# EasyEDA Pro project ProPrj_ESP32-CNC_2025-08-15.epro, board PCB1
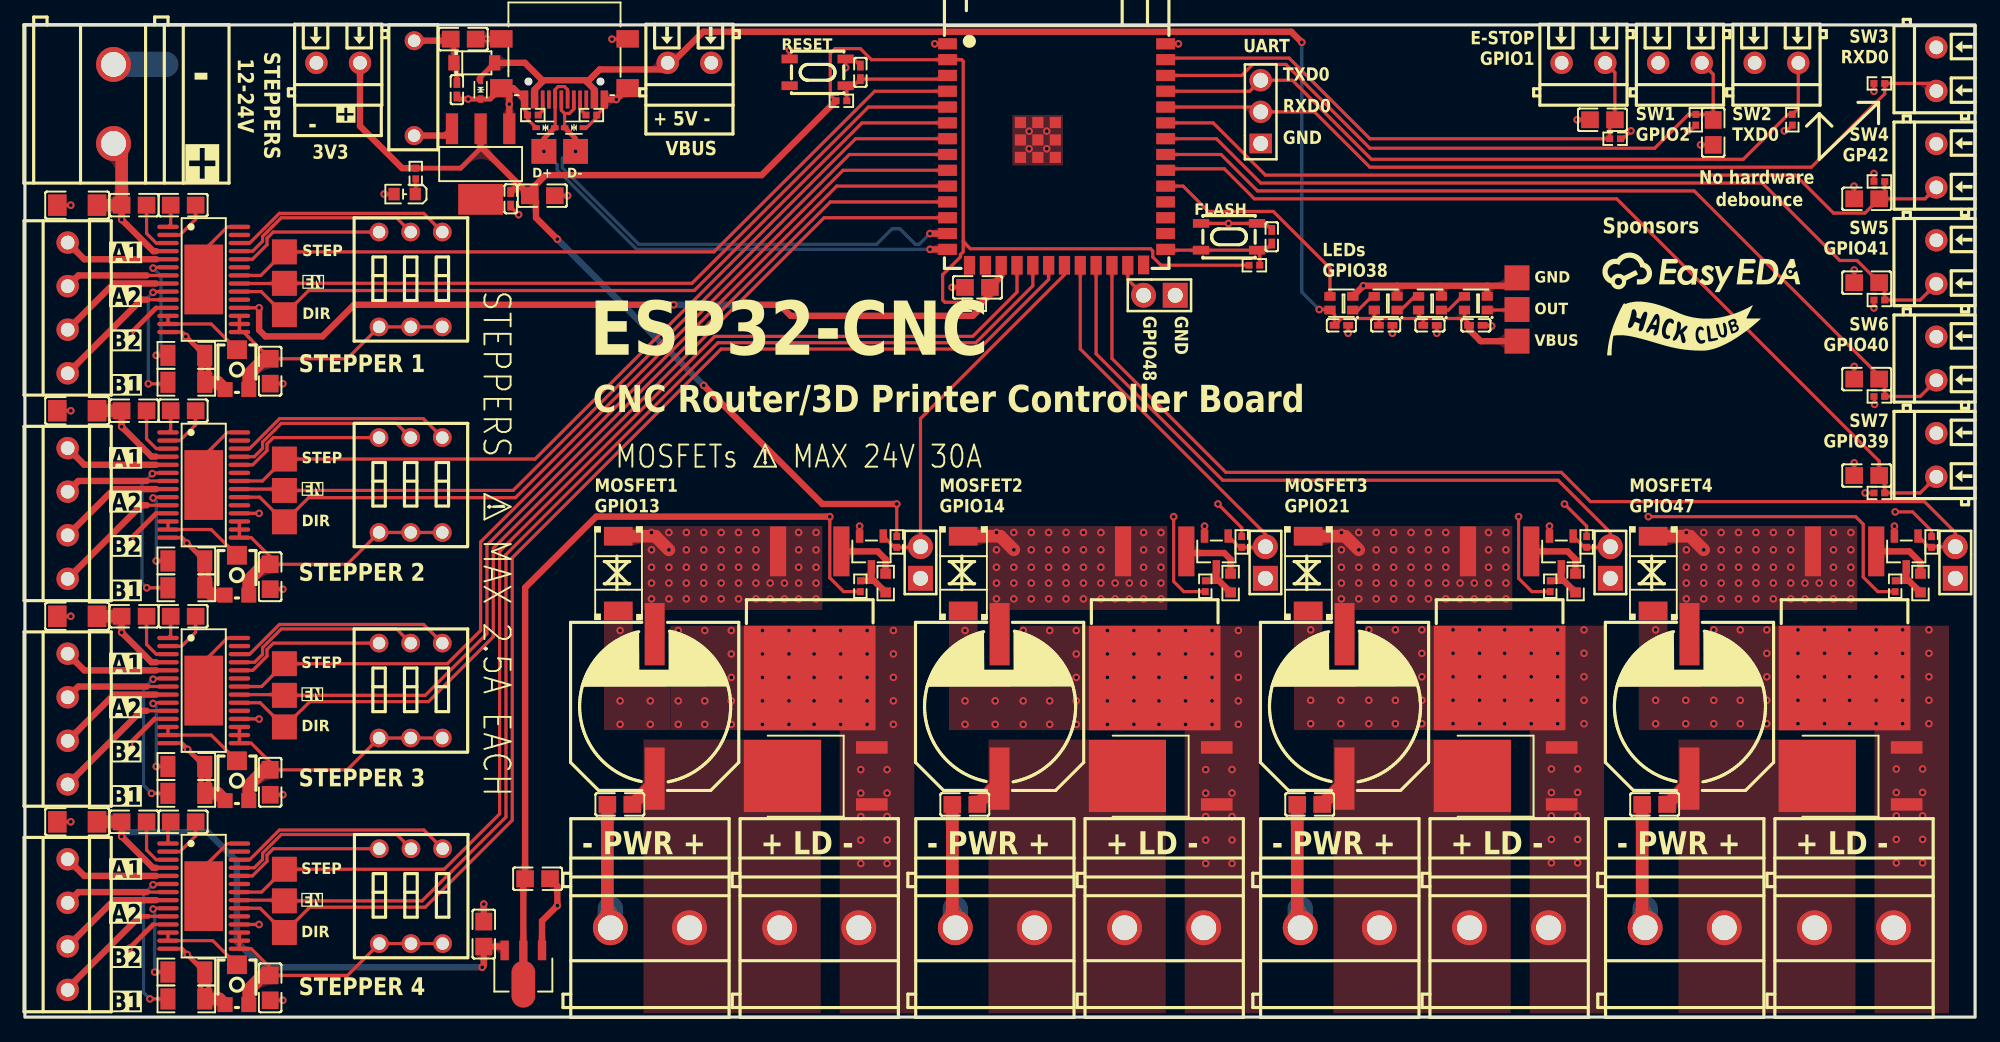
[diagram p1: board, top side]
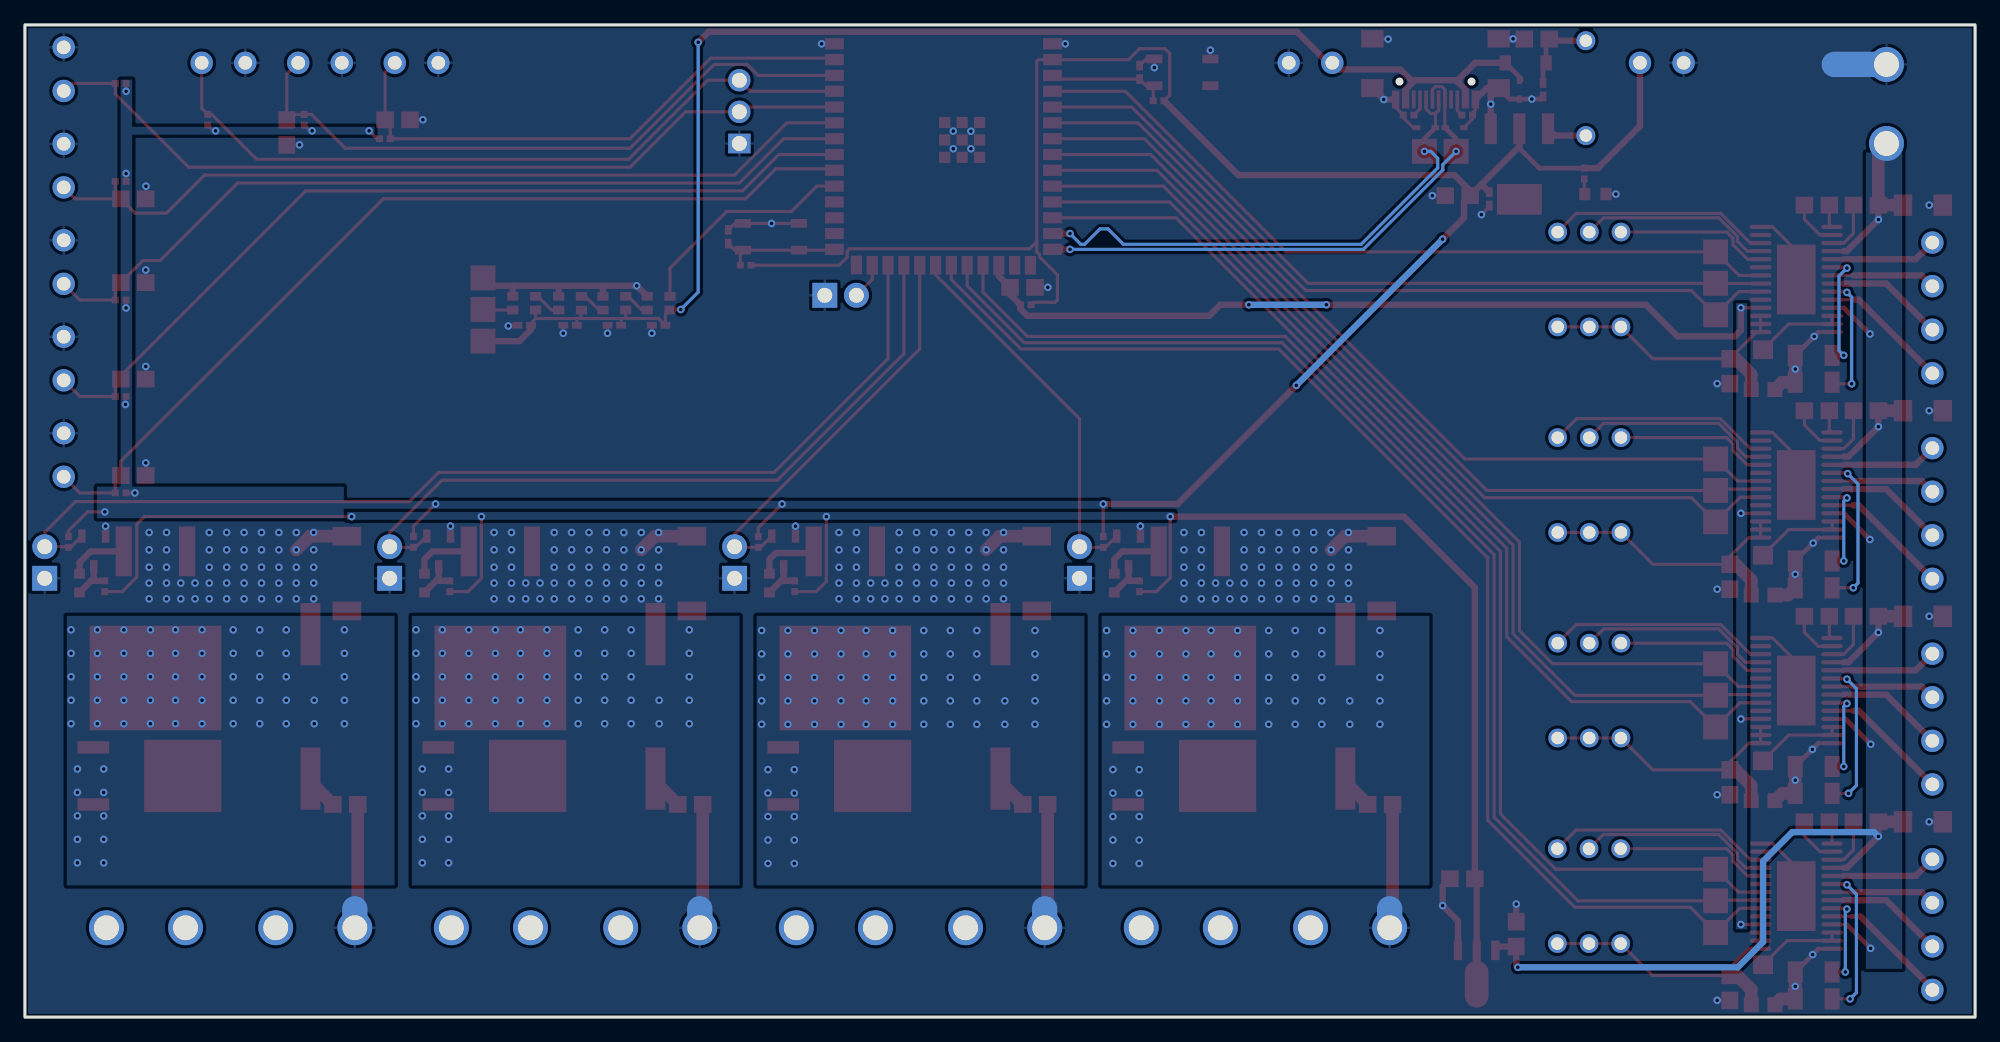
[diagram p2: board, bottom side, seen from below]

Outline 156.53 x 79.69 mm; copper layers: Top Layer, Bottom Layer. Coordinates in mm from the lower left corner of the outline.
Outline path: rectangle 0,79.69 156.53,0
Stack: Top Layer 0.035mm / Dielectric1 1.51mm FR4 er 4.5 / Bottom Layer 0.035mm

## Design rules (mm)
net D+: DP1
net D-: DP1
template: JLCPCB Capability(Two Layers Board)
spacing copperThickness1oz (default): track to track 0.102, other pairs 0.152 to 0.3
spacing copperThickness2oz: track to track 0.203, other pairs 0.152 to 0.3
track width copperThickness1oz (default): min 0.127, default 0.254, max 2.54
track width copperThickness2oz: min 0.203, default 0.254, max 2.54
differential pair differentialPair (default): width min 0.127, default 0.254, max 2.54; gap min 0.152, default 0.152
via viaSize (default): diameter min 0.5, default 0.61, max 10; hole min 0.3, default 0.305, max 6.3

## Placement (name value [footprint] x y rotation side)
C1  100nF  [C0805]  41.53 65.98 180 top
C2  100nF  [C0805]  35.18 78.55 0 top
C3  10uF  [C0402]  34.67 74.49 90 top
C4  10uF  [C0402]  38.99 65.72 90 top
C5  1uF  [C0402]  67.06 75.88 270 top
C8  100nF  [C0805]  8.76 32.2 0 top
C9  10nF  [C0805]  12.7 32.2 180 top
C10  470uF  [CAP-SMD_BD12.5-L13.0-W13.0-RD]  105.92 24.96 270 top
C11  100nF  [C0805]  103.12 17.08 0 top
C12  2.2uF  [C0805]  36.83 6.67 270 top
C14  2.2uF  [C0805]  41.15 11.11 180 top
C15  470nF  [C0805]  19.69 18.86 90 top
C18  4.7uF  [C1206]  4.19 65.22 0 top
C19  2.2uF  [C0805]  76.45 58.61 0 top
C21  10nF  [C0805]  12.7 15.69 180 top
C22  470nF  [C0805]  19.69 2.35 90 top
C23  100nF  [C0805]  8.76 15.69 0 top
C24  100nF  [C0805]  126.62 72.07 180 top
C25  100nF  [C0805]  135.51 71.06 270 top
C31  4.7uF  [C1206]  4.19 32.2 0 top
C34  4.7uF  [C1206]  4.19 48.71 0 top
C37  4.7uF  [C1206]  4.19 15.69 0 top
C40  10nF  [C0805]  12.7 65.22 180 top
C41  470nF  [C0805]  19.69 51.88 90 top
C42  100nF  [C0805]  8.76 65.22 0 top
C43  10nF  [C0805]  12.7 48.71 180 top
C44  470nF  [C0805]  19.69 35.37 90 top
C45  100nF  [C0805]  8.76 48.71 0 top
C46  100nF  [C0805]  147.83 65.72 180 top
C47  100nF  [C0805]  147.83 58.99 180 top
C48  100nF  [C0805]  147.83 51.25 180 top
C49  100nF  [C0805]  147.83 43.5 180 top
C50  470uF  [CAP-SMD_BD12.5-L13.0-W13.0-RD]  133.6 24.96 270 top
C51  100nF  [C0805]  130.81 17.08 0 top
C52  470uF  [CAP-SMD_BD12.5-L13.0-W13.0-RD]  50.55 24.96 270 top
C53  100nF  [C0805]  47.75 17.08 0 top
C54  470uF  [CAP-SMD_BD12.5-L13.0-W13.0-RD]  78.23 24.96 270 top
C55  100nF  [C0805]  75.44 17.08 0 top
C60  1uF  [C0402]  100.08 62.68 270 top
C61  10uF  [C0402]  105.66 55.56 0 top
C62  10uF  [C0402]  109.22 55.56 0 top
C63  10uF  [C0402]  112.78 55.56 0 top
C64  10uF  [C0402]  116.46 55.56 0 top
D1  LESD5D5.0CT1G  [SOD-523_L1.2-W0.8-LS1.6-BI]  41.78 71.44 0 top
D2  LESD5D5.0CT1G  [SOD-523_L1.2-W0.8-LS1.6-BI]  44.07 71.44 180 top
D3  LESD5D5.0CT1G  [SOD-523_L1.2-W0.8-LS1.6-BI]  36.58 74.49 90 top
D4  1N5819HW-7-F  [SOD-123_L2.7-W1.6-LS3.7-RD]  36.07 76.65 0 top
D6  SMBJ24CA  [SMBG_L4.3-W3.6-LS6.2-BI]  103 35.62 270 top
D7  SMBJ24CA  [SMBG_L4.3-W3.6-LS6.2-BI]  130.68 35.62 270 top
D8  SMBJ24CA  [SMBG_L4.3-W3.6-LS6.2-BI]  47.62 35.62 270 top
D9  SMBJ24CA  [SMBG_L4.3-W3.6-LS6.2-BI]  75.31 35.62 270 top
D+  -  [Test-Point-0.5mm]  41.66 69.53 0 top
D-  -  [Test-Point-0.5mm]  44.2 69.53 0 top
DIR  -  [Test-Point-0.5mm]  20.83 56.41 0 top
DIR#2  -  [Test-Point-0.5mm]  20.83 23.31 0 top
DIR#3  -  [Test-Point-0.5mm]  20.83 39.78 0 top
DIR#4  -  [Test-Point-0.5mm]  20.83 6.8 0 top
EN  -  [Test-Point-0.5mm]  20.83 9.34 0 top
EN#2  -  [Test-Point-0.5mm]  20.83 42.3 0 top
EN#3  -  [Test-Point-0.5mm]  20.83 58.94 0 top
EN#4  -  [Test-Point-0.5mm]  20.83 25.85 0 top
FLASH  TS-1089S-02526  [SW-SMD_4P-L4.2-W3.3-P2.15-LS5.1]  96.65 62.68 0 top
GND  -  [Test-Point-0.5mm]  119.76 59.37 0 top
H1  PZ254V-11-02P  [HDR-TH_2P-P2.54-V-M]  127.25 36.51 270 top
H2  PZ254V-11-02P  [HDR-TH_2P-P2.54-V-M]  154.94 36.51 270 top
H3  PZ254V-11-02P  [HDR-TH_2P-P2.54-V-M]  71.88 36.51 270 top
H4  PZ254V-11-02P  [HDR-TH_2P-P2.54-V-M]  99.57 36.51 270 top
H5  PZ254V-11-02P  [HDR-TH_2P-P2.54-V-M]  91.06 57.98 0 top
H6  2.54-1*3P针  [HDR-TH_3P-P2.54-V-M-1]  99.19 72.71 90 top
LED1  WS2812B-2020  [LED-SMD_4P-L2.0-W2.0-TL_WS2812B-2020]  105.66 57.34 180 top
LED2  A-SP192DGHC-C01-4T  [LED0603-FD]  30.48 66.1 0 top
LED3  WS2812B-2020  [LED-SMD_4P-L2.0-W2.0-TL_WS2812B-2020]  109.22 57.34 180 top
LED4  WS2812B-2020  [LED-SMD_4P-L2.0-W2.0-TL_WS2812B-2020]  112.78 57.34 180 top
LED5  WS2812B-2020  [LED-SMD_4P-L2.0-W2.0-TL_WS2812B-2020]  116.46 57.34 180 top
OUT  -  [Test-Point-0.5mm]  119.76 56.83 0 top
P1  XY350V-3.5-4P  [CONN-TH_XY350V-3.5-4P]  3.43 23.94 90 top
P2  XY350V-3.5-4P  [CONN-TH_XY350V-3.5-4P]  3.43 7.43 90 top
P3  XY350V-3.5-4P  [CONN-TH_XY350V-3.5-4P]  3.43 56.96 90 top
P4  XY350V-3.5-4P  [CONN-TH_XY350V-3.5-4P]  3.43 40.45 90 top
Q3  IRF3205STRLPBF  [TO-263-2_L10.0-W9.1-P5.08-LS15.2-TL]  118.36 32.32 270 top
Q4  BSS138LT1G  [SOT-23-3_L2.9-W1.6-P1.90-LS2.8-BR]  123.32 37.4 90 top
Q5  IRF3205STRLPBF  [TO-263-2_L10.0-W9.1-P5.08-LS15.2-TL]  146.05 32.32 270 top
Q6  BSS138LT1G  [SOT-23-3_L2.9-W1.6-P1.90-LS2.8-BR]  151 37.4 90 top
Q7  IRF3205STRLPBF  [TO-263-2_L10.0-W9.1-P5.08-LS15.2-TL]  62.99 32.32 270 top
Q8  BSS138LT1G  [SOT-23-3_L2.9-W1.6-P1.90-LS2.8-BR]  67.94 37.4 90 top
Q9  IRF3205STRLPBF  [TO-263-2_L10.0-W9.1-P5.08-LS15.2-TL]  90.68 32.32 270 top
Q10  BSS138LT1G  [SOT-23-3_L2.9-W1.6-P1.90-LS2.8-BR]  95.63 37.4 90 top
R1  5.1kΩ  [R0402]  45.47 72.45 0 top
R2  5.1kΩ  [R0402]  40.77 72.45 180 top
R3  10kΩ  [R0402]  98.68 60.39 180 top
R4  10kΩ  [R0402]  65.53 73.6 180 top
R10  200Ω  [R0402]  31.37 67.76 90 top
R11  100mΩ  [R1206]  12.95 17.97 0 top
R12  100mΩ  [R1206]  12.95 20.13 0 top
R13  22Ω  [R0603]  124.46 34.86 90 top
R14  10kΩ  [R0402]  122.43 34.61 270 top
R15  10kΩ  [R0402]  125.35 38.16 90 top
R16  10kΩ  [R0402]  76.2 57.21 180 top
R17  10kΩ  [R0402]  127.63 70.55 0 top
R18  100mΩ  [R1206]  12.95 1.46 0 top
R19  100mΩ  [R1206]  12.95 3.62 0 top
R20  10kΩ  [R0402]  134.11 72.07 270 top
R21  10kΩ  [R0402]  141.86 72.07 270 top
R22  10kΩ  [R0402]  148.84 74.99 180 top
R23  100mΩ  [R1206]  12.95 53.15 0 top
R24  100mΩ  [R1206]  12.95 50.99 0 top
R25  100mΩ  [R1206]  12.95 34.48 0 top
R26  100mΩ  [R1206]  12.95 36.64 0 top
R27  10kΩ  [R0402]  148.84 67.12 180 top
R28  10kΩ  [R0402]  148.84 57.6 180 top
R29  10kΩ  [R0402]  148.84 49.85 180 top
R30  10kΩ  [R0402]  148.84 42.1 180 top
R31  22Ω  [R0603]  152.15 34.86 90 top
R32  10kΩ  [R0402]  150.11 34.61 270 top
R33  10kΩ  [R0402]  153.03 38.16 90 top
R34  22Ω  [R0603]  69.09 34.86 90 top
R35  10kΩ  [R0402]  67.06 34.61 270 top
R36  10kΩ  [R0402]  69.98 38.16 90 top
R37  22Ω  [R0603]  96.77 34.86 90 top
R38  10kΩ  [R0402]  94.74 34.61 270 top
R39  10kΩ  [R0402]  97.66 38.16 90 top
RESET  TS-1089S-02526  [SW-SMD_4P-L4.2-W3.3-P2.15-LS5.1]  63.63 75.88 0 top
RJ1  20kΩ  [RES-ADJ-SMD_TC33X-2-104E]  17.02 18.99 0 top
RJ2  20kΩ  [RES-ADJ-SMD_TC33X-2-104E]  17.02 2.6 0 top
RJ3  20kΩ  [RES-ADJ-SMD_TC33X-2-104E]  17.02 52.01 0 top
RJ4  20kΩ  [RES-ADJ-SMD_TC33X-2-104E]  17.02 35.5 0 top
STEP  -  [Test-Point-0.5mm]  20.83 61.46 0 top
STEP#2  -  [Test-Point-0.5mm]  20.83 44.83 0 top
STEP#3  -  [Test-Point-0.5mm]  20.83 28.39 0 top
STEP#4  -  [Test-Point-0.5mm]  20.83 11.88 0 top
SW3  SMQS-03R-TP  [SW-TH_SMQS-03B-TP]  30.96 26.23 0 top
SW4  SMQS-03R-TP  [SW-TH_SMQS-03B-TP]  30.99 9.72 0 top
SW5  SMQS-03R-TP  [SW-TH_SMQS-03B-TP]  30.96 59.25 0 top
SW6  SMQS-03R-TP  [SW-TH_SMQS-03B-TP]  30.96 42.74 0 top
U1  DRV8825PWPR  [HTSSOP-28_L9.7-W4.4-P0.65-LS6.4-BL-EP]  14.35 26.23 270 top
U2  ESP32-S3-WROOM-1-N16R8  [WIRELM-SMD_ESP32-S3-WROOM-1]  82.8 69.28 0 top
U3  GT-USB-9047A  [USB-C-SMD_GT-USB-9047A]  43.31 76.14 180 top
U4  AMS1117-3.3  [SOT-223-4_L6.5-W3.5-P2.30-LS7.0-BR]  36.58 68.52 90 top
U5  DB301V-3.5-2P-GN-S  [CONN-TH_DB301V-3.5-2P-GN]  25.15 76.65 180 top
U6  SMQS-01R-TP  [SW-TH_KF1001-01P-B0-FL-ON-01B]  31.24 74.61 0 top
U7  MBR20100DT  [TO-252-2_L6.5-W6.1-P4.58-LS10.0-BL]  119.76 19.37 90 top
U9  KF635-6.35-2P  [CONN-TH_P6.35_KF635-6.35-2P]  105.54 7.18 0 top
U10  KF635-6.35-2P  [CONN-TH_P6.35_KF635-6.35-2P]  119.13 7.18 0 top
U11  CJ78L12  [SOT-89-3_L4.5-W2.5-P1.50-LS4.2-BR]  40 4 90 top
U13  KF635-6.35-2P  [CONN-TH_P6.35_KF635-6.35-2P]  7.11 73.34 270 top
U14  DB301V-3.5-2P-GN-S  [CONN-TH_DB301V-3.5-2P-GN]  125.09 76.65 180 top
U15  DRV8825PWPR  [HTSSOP-28_L9.7-W4.4-P0.65-LS6.4-BL-EP]  14.35 9.72 270 top
U16  DB301V-3.5-2P-GN-S  [CONN-TH_DB301V-3.5-2P-GN]  132.84 76.65 180 top
U17  DB301V-3.5-2P-GN-S  [CONN-TH_DB301V-3.5-2P-GN]  140.59 76.65 180 top
U18  DB301V-3.5-2P-GN-S  [CONN-TH_DB301V-3.5-2P-GN]  153.42 76.14 90 top
U19  DRV8825PWPR  [HTSSOP-28_L9.7-W4.4-P0.65-LS6.4-BL-EP]  14.35 59.25 270 top
U20  DRV8825PWPR  [HTSSOP-28_L9.7-W4.4-P0.65-LS6.4-BL-EP]  14.35 42.74 270 top
U21  DB301V-3.5-2P-GN-S  [CONN-TH_DB301V-3.5-2P-GN]  153.42 68.39 90 top
U22  DB301V-3.5-2P-GN-S  [CONN-TH_DB301V-3.5-2P-GN]  153.42 60.64 90 top
U23  DB301V-3.5-2P-GN-S  [CONN-TH_DB301V-3.5-2P-GN]  153.42 52.9 90 top
U24  DB301V-3.5-2P-GN-S  [CONN-TH_DB301V-3.5-2P-GN]  153.42 45.15 90 top
U25  KF635-6.35-2P  [CONN-TH_P6.35_KF635-6.35-2P]  133.22 7.18 0 top
U26  KF635-6.35-2P  [CONN-TH_P6.35_KF635-6.35-2P]  146.81 7.18 0 top
U27  MBR20100DT  [TO-252-2_L6.5-W6.1-P4.58-LS10.0-BL]  147.45 19.37 90 top
U28  KF635-6.35-2P  [CONN-TH_P6.35_KF635-6.35-2P]  50.17 7.18 0 top
U29  KF635-6.35-2P  [CONN-TH_P6.35_KF635-6.35-2P]  63.75 7.18 0 top
U30  MBR20100DT  [TO-252-2_L6.5-W6.1-P4.58-LS10.0-BL]  64.39 19.37 90 top
U31  KF635-6.35-2P  [CONN-TH_P6.35_KF635-6.35-2P]  77.85 7.18 0 top
U32  KF635-6.35-2P  [CONN-TH_P6.35_KF635-6.35-2P]  91.44 7.18 0 top
U33  MBR20100DT  [TO-252-2_L6.5-W6.1-P4.58-LS10.0-BL]  92.07 19.37 90 top
U34  DB301V-3.5-2P-GN-S  [CONN-TH_DB301V-3.5-2P-GN]  53.34 76.65 180 top
VBUS  -  [Test-Point-0.5mm]  119.76 54.29 0 top

## Footprints (pads in the part's own frame, mm; a bottom-side part is the same pattern mirrored in y, then rotated)
C0402
  rect 0.79x0.54 smd: 1(-0.545,0) 2(0.545,0)
C0805
  rect 1.41x1.35 smd: 1(-1,0) 2(1,0)
C1206
  rect 1.485x1.728 smd: 1(-1.593,0) 2(1.593,0)
CAP-SMD_BD12.5-L13.0-W13.0-RD
  rect 5x1.6 smd: 1(5.8,0) 2(-5.8,0)
CONN-TH_DB301V-3.5-2P-GN
  round 1.8 hole 1.1: 1(-1.75,0) 2(1.75,0)
CONN-TH_P6.35_KF635-6.35-2P
  round 2.8 hole 2: 1(-3.175,0) 2(3.175,0)
CONN-TH_XY350V-3.5-4P
  round 1.8 hole 1.1: 1(-5.25,0) 2(-1.75,0) 3(1.75,0) 4(5.25,0)
HDR-TH_2P-P2.54-V-M
  round 2 hole 1.2: 1(-1.27,0)
  rect 2x2 hole 1.2: 2(1.27,0)
HDR-TH_3P-P2.54-V-M-1
  rect 1.575x1.8 hole 1.2: 1(-2.54,0)
  round 1.8 hole 1.2: 2(0,0) 3(2.54,0)
HTSSOP-28_L9.7-W4.4-P0.65-LS6.4-BL-EP
  oval 0.343x1.732 smd: 1(-4.225,-2.866) 2(-3.575,-2.866) 3(-2.925,-2.866) 4(-2.275,-2.866) 5(-1.625,-2.866) 6(-0.975,-2.866) 7(-0.325,-2.866) 8(0.325,-2.866) 9(0.975,-2.866) 10(1.625,-2.866) 11(2.275,-2.866) 12(2.925,-2.866) 13(3.575,-2.866) 14(4.225,-2.866) 15(4.225,2.866) 16(3.575,2.866) 17(2.925,2.866) 18(2.275,2.866) 19(1.625,2.866) 20(0.975,2.866) 21(0.325,2.866) 22(-0.325,2.866) 23(-0.975,2.866) 24(-1.625,2.866) 25(-2.275,2.866) 26(-2.925,2.866) 27(-3.575,2.866) 28(-4.225,2.866)
  rect 5.6x3.1 smd: 29(0,0)
LED0603-FD
  rect 0.9x1 smd: 1(-0.85,0) 2(0.85,0)
LED-SMD_4P-L2.0-W2.0-TL_WS2812B-2020
  rect 0.9x0.7 smd: 1(-0.915,0.55) 2(-0.915,-0.55) 3(0.915,-0.55) 4(0.915,0.55)
R0402
  rect 0.566x0.54 smd: 1(-0.433,0) 2(0.433,0)
R0603
  rect 0.806x0.864 smd: 1(-0.753,0) 2(0.753,0)
R1206
  rect 1.208x1.701 smd: 1(-1.479,0) 2(1.479,0)
RES-ADJ-SMD_TC33X-2-104E
  rect 1.2x1.2 smd: 1(-0.95,-1.6) 3(0.95,-1.6)
  rect 1.6x1.5 smd: 2(0,1.6)
SMBG_L4.3-W3.6-LS6.2-BI
  rect 1.5x2.3 smd: 1(-3,0) 2(3,0)
SOD-123_L2.7-W1.6-LS3.7-RD
  rect 0.91x1.22 smd: 1(-1.635,0) 2(1.635,0)
SOD-523_L1.2-W0.8-LS1.6-BI
  rect 0.6x0.4 smd: 1(-0.75,0) 2(0.75,0)
SOT-23-3_L2.9-W1.6-P1.90-LS2.8-BR
  rect 1.07x0.6 smd: 1(1.235,-0.95) 2(1.235,0.95) 3(-1.235,0)
SOT-89-3_L4.5-W2.5-P1.50-LS4.2-BR
  rect 1.575x0.672 smd: 1(1.356,-1.5) 3(1.356,1.5)
  custom 5.377x1.9 smd: 2(-1.356,0)
SOT-223-4_L6.5-W3.5-P2.30-LS7.0-BR
  rect 2.47x0.98 smd: 1(2.835,-2.3) 2(2.835,0) 3(2.835,2.3)
  rect 2.47x3.6 smd: 4(-2.835,0)
SW-SMD_4P-L4.2-W3.3-P2.15-LS5.1
  rect 1.3x0.7 smd: 1(-2.25,1.075) 2(2.25,1.075) 3(-2.25,-1.075) 4(2.25,-1.075)
SW-TH_KF1001-01P-B0-FL-ON-01B
  round 1.524 hole 1: 1(0,-3.81) 2(0,3.81)
SW-TH_SMQS-03B-TP
  round 1.5 hole 1: 1(-2.54,-3.81) 2(0,-3.81) 3(2.54,-3.81) 4(2.54,3.81) 5(0,3.81) 6(-2.54,3.81)
Test-Point-0.5mm
  rect 2x2 smd: 1(0,0)
TO-252-2_L6.5-W6.1-P4.58-LS10.0-BL
  rect 1x2.54 smd: 1(-2.29,-3.587) 3(2.29,-3.587)
  rect 5.8x6.2 smd: 2(0,3.587)
TO-263-2_L10.0-W9.1-P5.08-LS15.2-TL
  rect 4x1.3 smd: 1(-5.086,2.54) 3(-5.086,-2.54)
  rect 8.4x10.566 smd: 4(5.086,0)
USB-C-SMD_GT-USB-9047A
  rect 1.8x1.45 smd: 12(-5.07,1.524) 13(5.07,1.524)
  rect 1.8x1.4 smd: 14(-5.07,-2.437) 15(5.07,-2.437)
  rect 0.6x1.45 smd: A1B12(-3.2,2.437) A4B9(-2.4,2.437) A9B4(2.4,2.437) A12B1(3.2,2.437)
  rect 0.3x1.45 smd: A5(-1.25,2.437) A6(-0.25,2.437) A7(0.25,2.437) A8(1.25,2.437) B5(1.75,2.437) B6(0.75,2.437) B7(-0.75,2.437) B8(-1.75,2.437)
WIRELM-SMD_ESP32-S3-WROOM-1
  rect 1.5x0.9 smd: 1(-8.75,8.895) 2(-8.75,7.625) 3(-8.75,6.355) 4(-8.75,5.085) 5(-8.75,3.815) 6(-8.75,2.545) 7(-8.75,1.275) 8(-8.75,0.005) 9(-8.75,-1.265) 10(-8.75,-2.535) 11(-8.75,-3.805) 12(-8.75,-5.075) 13(-8.75,-6.345) 14(-8.75,-7.615) 27(8.75,-7.615) 28(8.75,-6.345) 29(8.75,-5.075) 30(8.75,-3.805) 31(8.75,-2.535) 32(8.75,-1.265) 33(8.75,0.005) 34(8.75,1.275) 35(8.75,2.545) 36(8.75,3.815) 37(8.75,5.085) 38(8.75,6.355) 39(8.75,7.625) 40(8.75,8.895)
  rect 0.9x1.5 smd: 15(-6.985,-8.895) 16(-5.715,-8.895) 17(-4.445,-8.895) 18(-3.175,-8.895) 19(-1.905,-8.895) 20(-0.635,-8.895) 21(0.635,-8.895) 22(1.905,-8.895) 23(3.175,-8.895) 24(4.445,-8.895) 25(5.715,-8.895) 26(6.985,-8.865)
  rect 0.9x0.9 smd: 41(-2.9,2.575) 41(-2.9,1.175) 41(-2.9,-0.225) 41(-1.5,2.575) 41(-1.5,1.175) 41(-1.5,-0.225) 41(-0.1,2.575) 41(-0.1,1.175) 41(-0.1,-0.225)

## Nets
As in the schematic, except:
GND: C1.1 C2.2 C3.1 C4.1 C5.1 C10.2 C11.1 C12.1 C14.1 C15.1 C18.1 C19.1 C22.1 C24.2 C25.2 C31.1 C34.1 C37.1 C41.1 C44.1 C46.2 C47.2 C48.2 C49.2 C50.2 C51.1 C52.2 C53.1 C54.2 C55.1 C60.1 C61.2 C62.2 C63.2 C64.2 D1.1 D2.1 D3.1 D6.1 D7.1 D8.1 D9.1 FLASH.1 FLASH.2 GND.1 H1.2 H2.2 H3.2 H4.2 H5.2 H6.1 LED1.2 LED2.1 LED3.2 LED4.2 LED5.2 Q3.3 Q4.2 Q5.3 Q6.2 Q7.3 Q8.2 Q9.3 Q10.2 R1.2 R2.2 R11.2 R12.2 R18.2 R19.2 R23.2 R24.2 R25.2 R26.2 RESET.1 RESET.2 RJ1.1 RJ2.1 RJ3.1 RJ4.1 U1.14 U1.28 U1.29 U2.1 U2.40 U2.41 U3.12 U3.13 U3.14 U3.15 U3.A1B12 U3.A12B1 U4.1 U5.2 U9.1 U11.1 U13.1 U14.2 U15.14 U15.28 U15.29 U16.2 U17.2 U18.2 U19.14 U19.28 U19.29 U20.14 U20.28 U20.29 U21.2 U22.2 U23.2 U24.2 U25.1 U28.1 U31.1 U34.1
VBUS: C61.1 C62.1 C63.1 C64.1 D3.2 D4.2 LED1.4 LED3.4 LED4.4 LED5.4 U3.A4B9 U3.A9B4 U34.2 VBUS.1
CH_EN: C5.2 R4.1 RESET.4 U2.3
D+: D1.2 D+.1 U2.14 U3.A6 U3.B6
D-: D2.2 D-.1 U2.13 U3.A7 U3.B7
DIR1: DIR.1 U2.6 U19.20
DIR2: DIR#3.1 U2.9 U20.20
DIR3: DIR#2.1 U1.20 U2.12
DIR4: DIR#4.1 U2.20 U15.20
GPIO0: C60.2 FLASH.3 FLASH.4 R3.1 U2.27
NENBL1: EN#3.1 U2.5 U19.21
NENBL2: EN#2.1 U2.8 U20.21
NENBL3: EN#4.1 U1.21 U2.11
NENBL4: EN.1 U2.19 U15.21
STEP1: STEP.1 U2.4 U19.22
STEP2: STEP#2.1 U2.7 U20.22
STEP3: STEP#3.1 U1.22 U2.10
STEP4: STEP#4.1 U2.18 U15.22
$1N4520: LED5.1 OUT.1

Pads without a net: RESET 3; U1 19 23 27; U2 15 16 26 28 29 30; U3 A8 B8; U4 4; U15 19 23 27; U19 19 23 27; U20 19 23 27

## Via types
v1: diameter 0.61, hole 0.305, Top Layer to Bottom Layer, 550 vias

## Routing (per net, layer and track width the routed paths; a pad name or vN(x,y) marks a point on that pad's centre or on a via; arc(x,y) is an arc through that point)
3V3: length 174.1
  Top Layer w0.254: 141.86,71.64 141.4,71.18 v1(141.22,71.18) ; R17.2 128.27,70.55 v1(128.91,71.18) ; R30.2 v1(147.7,42.1) ; R39.2 97.66,39.31 v1(95.76,41.21) ; R4.2 64.64,74.05 64.64,77.41 65.02,77.79 67.06,77.79 67.94,76.9 74.05,76.9 U2.2 75.18,76.9 75.31,76.77 75.31,62.29 ; R29.2 148.46,49.8 v1(148.46,49.21) ; R16.2 75.57,57.42 73.84,57.42 73.66,57.6 73.66,59.63 75.09,61.06 75.09,61.25 75.31,61.47 75.31,62.29 ; R28.2 v1(148.41,56.96) ; R36.2 v1(69.98,41.21) ; R15.2 125.35,39.43 v1(123.57,41.21) ; R22.2 v1(148.41,74.36) ; R33.2 153.03,39.05 151.51,40.58 v1(150.11,40.58) ; 75.31,62.29 75.89,61.71 90.35,61.71 90.53,61.53 90.53,61.05 91.19,60.39 R3.2 ; R27.2 v1(148.41,67.76) ; 134.11,71.64 133.66,71.18 v1(133.48,71.18)
  Top Layer w0.381: 36.58,69.93 36.58,69.79 34.98,68.19 R10.2
  Top Layer w0.508: U5.1 26.9,71.57 30.27,68.19 R10.2 ; v1(69.98,41.21) 64.01,41.21 v1(54.48,50.74) ; 36.58,71.35 36.58,69.93 39.63,66.88 ; C1.2 40.53,66.37 41.78,67.63 59.13,67.63 R4.2 ; C1.2 41.02,65.49 41.02,64.2 v1(42.74,62.48) ; C1.2 39.63,66.88 ; C4.2 39.02,66.27 39.63,66.88
  Bottom Layer w0.508: v1(42.74,62.48) v1(54.48,50.74)
12V: length 107.4
  Top Layer w0.254: v1(130.3,40.2) 146.94,40.2 147.55,39.59 147.55,35.34 148.72,34.18 R32.2 ; v1(64.6,40.2) 64.6,35.28 65.71,34.18 R35.2 ; v1(92.2,40.2) 92.2,34.99 93.02,34.18 R38.2 ; R14.2 120.96,34.18 119.89,35.24 v1(119.89,40.2)
  Top Layer w0.508: U11.2 40,10.97 C14.2 40.15,34.5 45.85,40.2 v1(64.6,40.2)
GND: length 203.7
  Top Layer w0.254: C24.2 v1(124.59,72.07) ; U15.29 14.35,12.04 16.26,13.94 U15.28 ; C31.1 v1(3.68,32.2) ; C63.2 v1(113.32,54.93) ; U1.28 16.26,30.45 14.35,28.55 U1.29 ; U2.1 v1(73.03,78.17) ; C19.1 v1(74.42,58.61) ; v1(47.12,78.55) 48.35,78.55 48.38,78.57 ; C41.1 v1(20.7,50.88) ; U3.A12B1 40.11,72.86 40.33,72.63 R2.2 40.33,72.14 D1.1 ; 12.56,55.02 U19.14 ; C61.2 v1(106.21,54.93) ; U2.40 v1(92.58,78.17) ; Q8.2 v1(67,39.43) ; FLASH.1 v1(96.6,63.75) FLASH.2 99.55,63.75 C60.1 ; C49.2 v1(146.83,44.51) ; C47.2 v1(146.83,60.01) ; U20.14 12.56,38.51 ; C34.1 v1(3.68,48.71) ; U20.28 16.26,46.96 14.35,45.06 U20.29 ; U15.14 12.56,5.49 ; C64.2 117.68,55.56 v1(117.73,55.51) ; C15.1 v1(20.7,17.86) ; C1.1 v1(43.56,65.98) ; C22.1 v1(20.7,1.35) ; C62.2 v1(109.76,54.93) ; Q6.2 v1(150.05,39.43) ; U19.29 14.35,61.57 16.26,63.47 U19.28 ; U3.A1B12 46.51,73.06 R1.2 45.9,72.25 45.08,71.44 D2.1 ; v1(39.62,64.45) 38.99,65.09 C4.1 ; C25.2 v1(134.49,70.06) ; 110.13,58.73 110.13,58.74 ; LED2.1 v1(28.83,66.1) ; C48.2 v1(146.83,52.26) ; C46.2 146.83,66.72 v1(146.81,66.74) ; 113.69,58.64 113.6,58.74 ; C44.1 v1(20.7,34.37) ; 12.56,22 U1.14 ; C5.1 66.53,76.96 RESET.2 v1(65.88,76.26) ; Q10.2 v1(94.68,39.43) ; Q4.2 v1(122.37,39.43) ; C37.1 v1(3.68,15.69) ; RESET.1 v1(61.38,77.66) ; C18.1 v1(3.68,65.22)
  Top Layer w0.381: R23.2 v1(12.91,54.67) 12.56,55.02 ; 12.56,38.51 v1(13,38.07) R26.2 ; 12.56,22 v1(13.06,21.5) R12.2 ; 12.56,5.49 v1(13.03,5.02) R19.2 ; C3.1 34.88,73.74 v1(35.58,73.74) D3.1 37.36,73.74 U3.13
  Top Layer w0.508: LED4.2 113.69,58.64 ; 38.88,71.35 v1(38.88,73.33) 38.88,73.97 U3.13 39.19,74.61 U3.A12B1 ; 117.4,58.74 119.13,58.74 GND.1 ; 117.4,58.74 v1(107.43,58.74) 106.58,57.89 ; 117.4,58.74 117.37,58.71 LED5.2 ; U11.1 41.5,7.73 v1(42.73,8.95) 42.73,10.53 C14.1 ; C12.1 v1(36.83,9.08) ; LED3.2 110.13,58.73 ; U3.15 38.21,78.55 C2.2 ; U3.A1B12 v1(47.46,73.7) 48.38,74.61
  Top Layer w1.016: RJ4.1 15.02,33.9 R25.2 v1(14.43,35.57) R26.2 ; U31.1 74.44,7.41 C55.1 ; U9.1 102.12,7.41 C11.1 ; D8.1 50.59,38.62 v1(51.69,37.53) ; v1(79.38,37.53) 78.28,38.62 D9.1 ; R23.2 v1(14.43,52.05) R24.2 15.48,50.99 RJ3.1 ; R19.2 v1(14.43,2.47) R18.2 15.61,1.46 RJ2.1 ; D7.1 133.65,38.62 v1(134.75,37.53) ; R12.2 v1(14.43,19.03) R11.2 15.48,17.97 RJ1.1 ; C53.1 46.75,7.41 U28.1 ; D6.1 105.97,38.62 v1(107.06,37.53) ; C51.1 129.81,7.41 U25.1
  Bottom Layer w2.032: U13.1 11.3,76.52 ; 102.36,8.7 U9.1 ; U31.1 74.68,8.7 ; U25.1 130.05,8.7 ; U28.1 46.99,8.7
  vias: v1(37.08,78.57) v1(50.29,38.93) v1(50.29,37.53) v1(50.29,36.13) v1(50.29,34.86) v1(50.29,33.59) v1(51.69,38.93) v1(51.69,36.13) v1(51.69,34.86) v1(51.69,33.59) v1(53.09,38.93) v1(53.09,37.53) v1(53.09,36.13) v1(53.09,34.86) v1(53.09,33.59) v1(54.48,38.93) v1(54.48,37.53) v1(54.48,36.13) v1(54.48,34.86) v1(54.48,33.59) v1(55.88,38.93) v1(55.88,37.53) v1(55.88,36.13) v1(55.88,34.86) v1(55.88,33.59) v1(57.28,38.93) v1(57.28,37.53) v1(57.28,36.13) v1(57.28,34.86) v1(57.28,33.59) v1(58.67,38.93) v1(58.67,37.53) v1(58.67,36.13) v1(58.67,34.86) v1(58.67,33.59) v1(59.82,34.86) v1(59.82,33.59) v1(60.96,34.86) v1(60.96,33.59) v1(62.1,38.93) v1(62.1,37.53) v1(62.1,36.13) v1(62.1,34.86) v1(62.1,33.59) v1(63.5,38.93) v1(63.5,37.53) v1(63.5,36.13) v1(63.5,34.86) v1(63.5,33.59) v1(77.98,38.93) v1(77.98,37.53) v1(77.98,36.13) v1(77.98,34.86) v1(77.98,33.59) v1(79.38,38.93) v1(79.38,36.13) v1(79.38,34.86) v1(79.38,33.59) v1(80.6,71.15) v1(80.6,69.75) v1(80.77,38.93) v1(80.77,37.53) v1(80.77,36.13) v1(80.77,34.86) v1(80.77,33.59) v1(82.02,71.16) v1(82.02,69.75) v1(82.17,38.93) v1(82.17,37.53) v1(82.17,36.13) v1(82.17,34.86) v1(82.17,33.59) v1(83.57,38.93) v1(83.57,37.53) v1(83.57,36.13) v1(83.57,34.86) v1(83.57,33.59) v1(84.96,38.93) v1(84.96,37.53) v1(84.96,36.13) v1(84.96,34.86) v1(84.96,33.59) v1(86.36,38.93) v1(86.36,37.53) v1(86.36,36.13) v1(86.36,34.86) v1(86.36,33.59) v1(87.5,34.86) v1(87.5,33.59) v1(88.65,34.86) v1(88.65,33.59) v1(89.79,38.93) v1(89.79,37.53) v1(89.79,36.13) v1(89.79,34.86) v1(89.79,33.59) v1(91.19,38.93) v1(91.19,37.53) v1(91.19,36.13) v1(91.19,34.86) v1(91.19,33.59) v1(105.66,38.93) v1(105.66,37.53) v1(105.66,36.13) v1(105.66,34.86) v1(105.66,33.59) v1(107.06,38.93) v1(107.06,36.13) v1(107.06,34.86) v1(107.06,33.59) v1(108.46,38.93) v1(108.46,37.53) v1(108.46,36.13) v1(108.46,34.86) v1(108.46,33.59) v1(109.85,38.93) v1(109.85,37.53) v1(109.85,36.13) v1(109.85,34.86) v1(109.85,33.59) v1(111.25,38.93) v1(111.25,37.53) v1(111.25,36.13) v1(111.25,34.86) v1(111.25,33.59) v1(112.65,38.93) v1(112.65,37.53) v1(112.65,36.13) v1(112.65,34.86) v1(112.65,33.59) v1(114.05,38.93) v1(114.05,37.53) v1(114.05,36.13) v1(114.05,34.86) v1(114.05,33.59) v1(115.19,34.86) v1(115.19,33.59) v1(116.33,34.86) v1(116.33,33.59) v1(117.47,38.93) v1(117.47,37.53) v1(117.47,36.13) v1(117.47,34.86) v1(117.47,33.59) v1(118.87,38.93) v1(118.87,37.53) v1(118.87,36.13) v1(118.87,34.86) v1(118.87,33.59) v1(133.35,38.93) v1(133.35,37.53) v1(133.35,36.13) v1(133.35,34.86) v1(133.35,33.59) v1(134.75,38.93) v1(134.75,36.13) v1(134.75,34.86) v1(134.75,33.59) v1(136.14,38.93) v1(136.14,37.53) v1(136.14,36.13) v1(136.14,34.86) v1(136.14,33.59) v1(137.54,38.93) v1(137.54,37.53) v1(137.54,36.13) v1(137.54,34.86) v1(137.54,33.59) v1(138.94,38.93) v1(138.94,37.53) v1(138.94,36.13) v1(138.94,34.86) v1(138.94,33.59) v1(140.34,38.93) v1(140.34,37.53) v1(140.34,36.13) v1(140.34,34.86) v1(140.34,33.59) v1(141.73,38.93) v1(141.73,37.53) v1(141.73,36.13) v1(141.73,34.86) v1(141.73,33.59) v1(142.88,34.86) v1(142.88,33.59) v1(144.02,34.86) v1(144.02,33.59) v1(145.16,38.93) v1(145.16,37.53) v1(145.16,36.13) v1(145.16,34.86) v1(145.16,33.59) v1(146.56,38.93) v1(146.56,37.53) v1(146.56,36.13) v1(146.56,34.86) v1(146.56,33.59)
VBUS: length 116.4
  Top Layer w0.254: 111.91,56.11 112.23,56.11 ; 111.91,56.11 108.65,56.11 ; 111.91,56.11 111.91,56.74 111.86,56.79 ; 112.23,56.11 C63.1 ; 112.23,56.11 115.53,56.11 ; 108.65,56.11 108.68,56.09 C62.1 ; 108.65,56.11 108.31,56.11 ; LED5.4 115.54,56.13 115.53,56.11 ; 115.53,56.11 115.91,55.72 C64.1 ; LED3.4 108.31,56.11 ; 108.31,56.11 105.67,56.11 C61.1 105.12,56.42 LED1.4 104.71,56.83 v1(103.89,56.83)
  Top Layer w0.381: D4.2 36.45,75.39 36.45,75.24
  Top Layer w0.508: C64.1 115.91,55.22 116.84,54.29 VBUS.1 ; 41.56,75.25 41.56,75.15 40.91,74.5 U3.A9B4 ; 41.56,75.25 45.27,75.25 ; 41.56,75.25 41.53,75.25 ; 45.27,75.25 45.11,75.09 45.72,74.49 45.72,73.71 ; 45.27,75.25 46.13,76.12 51.06,76.12 U34.2 51.94,76.65 54.44,79.14 101.65,79.14 v1(102.49,78.3) ; 41.43,75.25 41.53,75.25 ; 41.53,75.25 40.13,76.65 D4.2
  Bottom Layer w0.254: v1(103.89,56.83) 102.49,58.23 v1(102.49,78.3)
CH_EN: length 9.8
  Top Layer w0.254: U2.3 73.76,75.34 C5.2 66.53,74.81 RESET.4 65.97,74.72 R4.1
D+: length 43.2
  Top Layer w0.254: 42.56,71.46 U3.B6 42.55,73.71 42.55,74.49 42.8,74.74 43.31,74.74 43.56,74.49 U3.A6
  Top Layer w0.381: D1.2 41.66,70.56 v1(41.66,69.53)
  Top Layer w0.508: U2.14 v1(72.64,61.66)
  Bottom Layer w0.254: v1(72.64,61.66) 49.1,61.66 42.72,68.04 42.72,68.47 v1(41.66,69.53)
D-: length 43.2
  Top Layer w0.254: 43.31,72.58 43.32,72.57 D2.2 ; 43.31,72.58 43.71,72.58 44.06,72.93 U3.B7 ; 43.31,72.58 43.06,72.83 U3.A7
  Top Layer w0.381: D2.2 44.2,70.56 v1(44.2,69.53)
  Top Layer w0.508: U2.13 v1(72.64,62.93)
  Bottom Layer w0.254: v1(72.64,62.93) 71.78,62.07 71.47,62.07 70.23,63.31 69.6,63.31 68.36,62.07 49.27,62.07 43.13,68.21 43.13,68.97 43.69,69.53 v1(44.2,69.53)
DIR1: length 64
  Top Layer w0.254: U19.20 18.97,58.27 DIR.1 22.77,58.36 53.72,58.36 67.19,71.82 U2.6
DIR2: length 69.4
  Top Layer w0.254: U2.9 65.66,68.01 39.37,41.72 22.77,41.72 DIR#3.1 18.84,41.76 U20.20
DIR3: length 78.8
  Top Layer w0.254: U1.20 18.88,25.25 DIR#2.1 22.86,25.34 32.39,25.34 37.59,30.54 37.59,37.66 64.14,64.2 U2.12
DIR4: length 101
  Top Layer w0.254: U15.20 18.88,8.74 DIR#4.1 22.86,8.83 32.13,8.83 39.12,15.81 39.12,36.89 55.88,53.66 76.58,53.66 82.17,59.25 U2.20
E_STOP: length 45
  Top Layer w0.254: U2.39 91.68,77.03 101.47,77.03 107.95,70.55 R17.1 127.2,71.66 C24.1 127.62,75.87 U14.1
GPIO0: length 10.1
  Top Layer w0.254: R3.1 99.11,61.39 FLASH.4 ; FLASH.4 FLASH.3 91.62,61.6 U2.27 ; FLASH.4 99.55,61.6 C60.2
LEDS: length 18.2
  Top Layer w0.254: U2.31 92.96,66.74 95,64.71 100.2,64.71 104.75,60.16 LED1.3
LIM_1: length 53.4
  Top Layer w0.254: U2.38 97.67,75.63 98.55,76.52 101.22,76.52 107.95,69.79 130.81,69.79 133.53,72.51 R20.1 135.06,72.51 C25.1 135.51,75.73 U16.1
LIM_2: length 59.1
  Top Layer w0.254: 91.55,74.36 98.3,74.36 H6.3 101.73,75.25 108.08,68.9 137.92,68.9 141.53,72.51 R21.1 142.34,72.99 U17.1
LIM_3: length 67.4
  Top Layer w0.254: U18.1 152.81,74.99 R22.1 149.28,74.16 143.38,68.26 107.95,68.26 103.5,72.71 H6.2 98.8,73.09 U2.36
LIM_4: length 67.3
  Top Layer w0.254: R27.1 149.28,66.17 C46.1 ; C46.1 152.5,65.72 U21.1 ; C46.1 147.69,64.58 145.16,64.58 142.11,67.63 99.57,67.63 95.37,71.82 U2.35
LIM_5: length 68.3
  Top Layer w0.254: U22.1 152.12,57.6 R28.1 149.28,58.54 C47.1 147.05,60.77 145.67,60.77 139.45,66.99 99.19,66.99 95.63,70.55 U2.34
LIM_6: length 71.2
  Top Layer w0.254: U23.1 152.12,49.85 R29.1 149.28,50.8 C48.1 148.83,51.52 133.99,66.36 98.93,66.36 96.01,69.28 U2.33
LIM_7: length 74.5
  Top Layer w0.254: U24.1 152.12,42.1 R30.1 149.28,43.05 C49.1 148.83,44.66 127.76,65.72 98.68,65.72 96.27,68.14 91.68,68.14 U2.32
MOSFET1: length 30.8
  Top Layer w0.254: 68.9,38.64 69.8,37.73 R36.1 71.83,37.73 H3.1 71.88,48.07 83.44,59.63 U2.21
MOSFET2: length 32.1
  Top Layer w0.254: Q10.1 97.49,37.73 R39.1 99.52,37.73 H4.1 99.57,38.8 84.71,53.66 U2.22
MOSFET3: length 58.9
  Top Layer w0.254: Q4.1 125.17,37.73 R15.1 127.2,37.73 H1.1 127.25,38.93 123.06,43.12 96.14,43.12 85.98,53.28 U2.23
MOSFET4: length 85.5
  Top Layer w0.254: Q6.1 152.86,37.73 R33.1 153.09,37.78 H2.1 154.94,38.93 152.46,41.4 125.66,41.4 123.32,43.75 96.39,43.75 87.25,52.9 U2.24
NENBL1: length 62.7
  Top Layer w0.254: U19.21 20.81,58.92 EN#3.1 53.54,58.94 67.7,73.09 U2.5
NENBL2: length 68.1
  Top Layer w0.254: U20.21 20.72,42.41 EN#2.1 39.19,42.3 66.17,69.28 U2.8
NENBL3: length 77.4
  Top Layer w0.254: U2.11 64.65,65.47 37.08,37.91 37.08,30.8 32.13,25.85 EN#4.1 20.77,25.9 U1.21
NENBL4: length 98.2
  Top Layer w0.254: U15.21 20.77,9.39 EN.1 31.88,9.34 38.61,16.07 38.61,37.15 55.63,54.17 76.33,54.17 80.9,58.74 U2.19
NFAULT: length 72
  Top Layer w0.254: v1(18.8,23.94) 18.78,23.95 U1.18 ; U20.18 v1(18.8,40.46) ; U19.18 v1(18.8,56.97) ; U15.18 v1(18.8,7.44)
  Top Layer w0.508: U2.17 78.36,59.52 C19.2 77.45,58.04 R16.1 76.63,56.89 76.07,56.33 61.47,56.33 60.58,57.21 v1(58.29,57.21) ; v1(18.8,56.97) 18.8,55.18 19.3,54.67 23.88,54.67 26.42,57.21 v1(52.07,57.21)
  Bottom Layer w0.508: v1(52.07,57.21) v1(58.29,57.21)
STEP1: length 63
  Top Layer w0.254: U19.22 18.94,59.57 STEP.1 55.3,61.46 68.2,74.36 74.05,74.36
STEP2: length 68.2
  Top Layer w0.254: U20.22 19.06,43.06 STEP#2.1 40.95,44.83 66.68,70.55 U2.7
STEP3: length 77.7
  Top Layer w0.254: U1.22 18.99,26.55 STEP#3.1 33.91,28.39 36.58,31.05 36.58,38.16 65.16,66.74 U2.10
STEP4: length 96.9
  Top Layer w0.254: U2.18 79.63,58.23 76.07,54.67 55.37,54.67 38.1,37.4 38.1,16.32 33.66,11.88 STEP#4.1 18.99,10.04 U15.22
V_MOSFET1: length 2.8
  Top Layer w1.016: C53.2 50.55,18.88 C52.1
V_MOSFET2: length 2.8
  Top Layer w1.016: C55.2 78.23,18.88 C54.1
V_MOSFET3: length 2.8
  Top Layer w1.016: C11.2 105.92,18.88 C10.1
V_MOSFET4: length 2.8
  Top Layer w1.016: C51.2 133.6,18.88 C50.1
V_STEPPER: length 93.6
  Top Layer w0.254: U15.11 10.3,7.44 ; U20.11 10.54,40.46 ; U20.4 10.54,45.01 ; U19.4 10.54,61.52 ; U19.11 10.54,56.97 ; U1.11 10.41,23.95 ; U1.4 10.54,28.5 ; U15.4 10.54,11.99
  Top Layer w0.381: 10.54,56.97 v1(8.44,54.87) ; 10.54,40.46 v1(8.44,38.36) ; 10.41,23.95 v1(8.38,21.91) ; 10.29,7.43 v1(8.38,5.53)
  Top Layer w0.508: U11.3 38.19,5.67 C12.2 36.83,4.13 v1(36.7,4) ; 10.53,45.02 10.16,45.02 v1(7.76,47.42) C45.1 ; C42.1 v1(7.76,64.06) 10.3,61.52 10.54,61.52 ; C8.1 v1(7.76,30.9) 10.16,28.5 10.54,28.5 ; 10.54,11.99 10.28,11.99 v1(7.76,14.51) C23.1
  Top Layer w1.016: C18.2 C42.1 7.76,69.52 U13.2 ; C34.2 C45.1 ; C31.2 C8.1 ; C37.2 C23.1
  Bottom Layer w0.508: v1(7.76,14.51) 8.11,14.86 14.67,14.86 17.02,12.51 17.02,6.03 19.05,4 v1(36.7,4)
VSYS: length 6.7
  Top Layer w0.381: 34.54,76.53 D4.1 34.43,78.3 C2.1 ; C3.2 34.67,76.53
  Top Layer w0.508: U6.2 34.05,78.42 C2.1
$1N1589: length 1.4
  Top Layer w0.254: U3.B5 41.56,72.81 R2.1
$1N1590: length 1.4
  Top Layer w0.254: U3.A5 44.56,72.93 R1.1
$1N4191: length 1.2
  Top Layer w0.254: LED2.2 31.37,66.14 R10.1
$1N4483: length 2.2
  Top Layer w0.254: 106.58,56.79 107.02,56.79 108.12,57.89 LED3.3
$1N4489: length 2.2
  Top Layer w0.254: 111.86,57.89 111.55,57.89 110.45,56.79 LED3.1
$1N4496: length 2.3
  Top Layer w0.254: LED4.1 114.26,56.79 115.36,57.89 LED5.3
$1N4520: length 2.4
  Top Layer w0.254: OUT.1 119.72,56.79 LED5.1
$1N5697: length 7
  Top Layer w0.254: U1.12 U1.13 14.95,22.65 RJ1.2
$1N5816: length 23.5
  Top Layer w0.254: U1.17 U1.16 U1.15 18.16,22 19.69,20.48 C15.2 25.87,19.86 SW3.1 SW3.2 SW3.3
  Top Layer w1.016: RJ1.3 17.97,18.61 19.41,20.05 19.49,20.05 C15.2
$1N6278: length 4.3
  Top Layer w0.254: U1.3 10.54,29.15 9.76,29.93 C8.2
$1N6351: length 1.8
  Top Layer w0.254: C9.2 11.7,30.67 U1.1
$1N6357: length 4
  Top Layer w0.254: C9.1 13.7,30.91 12.57,29.78 11.5,29.78 U1.2
$1N6441: length 8.4
  Top Layer w0.254: U1.7 9.78,26.55
  Top Layer w0.508: 9.78,26.55 4.29,26.55 P1.3
$1N6459: length 9.6
  Top Layer w0.254: U1.8 10.54,25.9
  Top Layer w0.508: P1.2 7.14,25.9 10.54,25.9
$1N6477: length 10.5
  Top Layer w0.254: U1.10 9.78,24.6
  Top Layer w0.508: P1.1 9.34,24.6 9.78,24.6
$1N6621: length 7.3
  Top Layer w0.254: v1(10.29,25.19) 10.35,25.25 U1.9 ; R12.1 v1(10.54,20.13)
  Bottom Layer w0.254: v1(10.29,25.19) 10.54,24.94 v1(10.54,20.13)
$1N6629: length 12.3
  Top Layer w0.254: R11.1 v1(10.16,17.97) ; U1.6 10.29,27.2
  Bottom Layer w0.254: v1(10.16,17.97) 9.53,18.61 9.53,26.38 v1(10.29,27.14)
$1N6899: length 3.3
  Top Layer w0.508: U6.1 33.73,70.8 34.28,71.35
$1N7080:
  vias: v1(103.2,31.1) v1(103.2,29.22) v1(103.2,27.33) v1(103.2,25.45) v1(103.2,23.56) v1(105.62,25.45) v1(105.62,23.56) v1(107.87,31.1) v1(107.87,29.22) v1(107.87,27.33) v1(107.87,25.45) v1(107.87,23.56) v1(110,31.1) v1(110,29.22) v1(110,27.33) v1(110,25.45) v1(110,23.56) v1(112.13,31.1) v1(112.13,29.22) v1(112.13,27.33) v1(112.13,25.45) v1(112.13,23.56) v1(114.63,31.1) v1(114.63,29.22) v1(114.63,27.33) v1(114.63,25.45) v1(114.63,23.56) v1(116.76,31.11) v1(116.76,29.22) v1(116.76,27.34) v1(116.76,25.45) v1(116.76,23.57) v1(118.77,31.1) v1(118.77,29.22) v1(118.77,27.33) v1(118.77,25.45) v1(118.77,23.56) v1(120.9,31.1) v1(120.9,29.22) v1(120.9,27.33) v1(120.9,25.45) v1(120.9,23.56) v1(122.52,19.93) v1(122.52,18.04) v1(122.52,16.16) v1(122.52,14.27) v1(122.52,12.39) v1(123.03,31.1) v1(123.03,29.22) v1(123.03,27.33) v1(123.03,25.45) v1(123.03,23.56) v1(124.63,19.93) v1(124.63,18.04) v1(124.63,16.16) v1(124.63,14.28) v1(124.63,12.39) v1(125.14,31.11) v1(125.14,29.22) v1(125.14,27.34) v1(125.14,25.45) v1(125.14,23.57)
$1N7575: length 5
  Top Layer w0.508: R13.2 124.46,36.77 123.82,37.41 Q3.1
$1N8736: length 3.6
  Top Layer w0.508: Q4.3 123.32,35.25 123.53,35.04 ; R13.1 123.53,35.04 ; 123.53,35.04 R14.1
$1N10964: length 7
  Top Layer w0.254: U15.12 U15.13 15.08,6.14 RJ2.2
$1N10970: length 22.6
  Top Layer w0.254: U15.17 U15.16 U15.15 18.16,5.49 19.69,3.97 C22.2 25.89,3.35 27.94,5.4 ; SW4.1 SW4.2 SW4.3
  Top Layer w1.016: RJ2.3 17.97,2.22 19.09,3.35 C22.2
$1N11009: length 4.3
  Top Layer w0.254: U15.3 10.54,12.64 9.76,13.42 C23.2
$1N11011: length 1.8
  Top Layer w0.254: C21.2 11.48,15.47 U15.1
$1N11016: length 3.9
  Top Layer w0.254: C21.1 13.7,14.55 12.45,13.29 U15.2
$1N11021: length 8.4
  Top Layer w0.254: U15.7 9.78,10.04
  Top Layer w0.508: P2.3 4.29,10.04 9.78,10.04
$1N11025: length 9.6
  Top Layer w0.254: U15.8 10.54,9.39
  Top Layer w0.508: 10.54,9.39 7.14,9.39 P2.2
$1N11029: length 10.6
  Top Layer w0.254: U15.10 9.91,8.09
  Top Layer w0.381: 9.91,8.09 9.21,8.09
  Top Layer w0.508: 9.21,8.09 3.43,2.31 P2.1
$1N11033: length 7.4
  Top Layer w0.254: U15.9 10.29,8.74 ; R19.1 v1(10.41,3.62)
  Bottom Layer w0.254: v1(10.41,3.62) 10.41,8.55 v1(10.29,8.68)
$1N11038: length 12.4
  Top Layer w0.254: U15.6 10.35,10.69 v1(10.29,10.63) ; R18.1 v1(10.03,1.46)
  Bottom Layer w0.254: v1(10.03,1.46) 9.53,1.97 9.53,9.87 v1(10.29,10.63)
$1N13018: length 7
  Top Layer w0.254: RJ3.2 14.95,55.67 U19.13 U19.12
$1N13024: length 23
  Top Layer w0.254: U19.17 U19.16 U19.15 17.54,55.02 17.93,54.64 17.93,54.64 18.1,54.47 18.1,54.47 C41.2 25.87,52.88 SW5.1 SW5.2 SW5.3
  Top Layer w1.016: RJ3.3 17.97,51.63 19.22,52.88 C41.2
$1N13063: length 4.3
  Top Layer w0.254: U19.3 11.48,62.17 10.54,62.17 9.76,62.95 C42.2
$1N13065: length 1.8
  Top Layer w0.254: U19.1 11.7,63.69 C40.2
$1N13070: length 3.9
  Top Layer w0.254: C40.1 13.7,64.08 12.45,62.82 U19.2
$1N13075: length 8.4
  Top Layer w0.254: U19.7 9.78,59.57
  Top Layer w0.508: 9.78,59.57 4.29,59.57 P3.3
$1N13079: length 9.6
  Top Layer w0.254: U19.8 10.54,58.92
  Top Layer w0.508: 10.54,58.92 7.14,58.92 P3.2
$1N13083: length 10.5
  Top Layer w0.254: U19.10 9.81,57.62
  Top Layer w0.508: 9.81,57.62 9.34,57.62 P3.1
$1N13087: length 10.3
  Top Layer w0.254: R24.1 11.35,50.86 v1(9.91,50.86) ; U19.9 10.29,58.27
  Bottom Layer w0.254: v1(10.29,58.21) 9.91,57.83 v1(9.91,50.86)
$1N13092: length 9.6
  Top Layer w0.254: U19.6 10.29,60.22 ; R23.1 v1(10.54,53.15)
  Bottom Layer w0.254: v1(10.29,60.16) 10.92,59.53 10.92,53.53 v1(10.54,53.15)
$1N13121: length 7
  Top Layer w0.254: RJ4.2 14.95,39.16 U20.13 U20.12
$1N13127: length 23.3
  Top Layer w0.254: SW6.3 SW6.2 SW6.1 25.87,36.37 C44.2 19.69,36.99 18.16,38.51 U20.15 U20.16 U20.17
  Top Layer w1.016: C44.2 19.22,36.37 17.97,35.12 RJ4.3
$1N13166: length 4.3
  Top Layer w0.254: U20.3 10.54,45.66 9.76,46.44 C45.2
$1N13168: length 1.8
  Top Layer w0.254: U20.1 11.7,47.18 C43.2
$1N13173: length 3.9
  Top Layer w0.254: U20.2 12.45,46.31 13.7,47.57 C43.1
$1N13178: length 8.4
  Top Layer w0.254: U20.7 9.78,43.06
  Top Layer w0.508: 9.78,43.06 4.29,43.06 P4.3
$1N13182: length 9.6
  Top Layer w0.254: U20.8 10.54,42.41
  Top Layer w0.508: P4.2 7.14,42.41 10.54,42.41
$1N13186: length 10.5
  Top Layer w0.254: U20.10 9.78,41.11
  Top Layer w0.508: 9.78,41.11 9.34,41.11 P4.1
$1N13190: length 7.3
  Top Layer w0.254: R26.1 v1(10.54,36.64) ; U20.9 10.29,41.76
  Bottom Layer w0.254: v1(10.54,36.64) 10.54,41.45 v1(10.29,41.7)
$1N13195: length 12.6
  Top Layer w0.254: R25.1 v1(9.78,34.48) ; U20.6 10.29,43.71 v1(10.23,43.65)
  Bottom Layer w0.254: v1(9.78,34.48) 9.4,34.86 9.4,42.82 v1(10.23,43.65)
$1N14832:
  vias: v1(130.89,31.1) v1(130.89,29.22) v1(130.89,27.33) v1(130.89,25.45) v1(130.89,23.56) v1(133.31,25.45) v1(133.31,23.56) v1(135.55,31.1) v1(135.55,29.22) v1(135.55,27.33) v1(135.55,25.45) v1(135.55,23.56) v1(137.68,31.1) v1(137.68,29.22) v1(137.68,27.33) v1(137.68,25.45) v1(137.68,23.56) v1(139.81,31.1) v1(139.81,29.22) v1(139.81,27.33) v1(139.81,25.45) v1(139.81,23.56) v1(142.31,31.1) v1(142.31,29.22) v1(142.31,27.33) v1(142.31,25.45) v1(142.31,23.56) v1(144.44,31.11) v1(144.44,29.22) v1(144.44,27.34) v1(144.44,25.45) v1(144.44,23.57) v1(146.46,31.1) v1(146.46,29.22) v1(146.46,27.33) v1(146.46,25.45) v1(146.46,23.56) v1(148.58,31.1) v1(148.58,29.22) v1(148.58,27.33) v1(148.58,25.45) v1(148.58,23.56) v1(150.21,19.93) v1(150.21,18.04) v1(150.21,16.16) v1(150.21,14.27) v1(150.21,12.39) v1(150.71,31.1) v1(150.71,29.22) v1(150.71,27.33) v1(150.71,25.45) v1(150.71,23.56) v1(152.32,19.93) v1(152.32,18.04) v1(152.32,16.16) v1(152.32,14.28) v1(152.32,12.39) v1(152.82,31.11) v1(152.82,29.22) v1(152.82,27.34) v1(152.82,25.45) v1(152.82,23.57)
$1N14842: length 4.8
  Top Layer w0.508: Q5.1 151.25,37.41 152.15,36.51 R31.2
$1N14857: length 3.6
  Top Layer w0.508: R32.1 151.21,35.04 ; 151.21,35.04 151,35.25 Q6.3 ; 151.21,35.04 R31.1
$1N15959:
  vias: v1(47.77,31.05) v1(47.77,29.17) v1(47.77,27.28) v1(47.77,25.4) v1(47.77,23.51) v1(50.19,25.4) v1(50.19,23.51) v1(52.44,31.05) v1(52.44,29.17) v1(52.44,27.28) v1(52.44,25.4) v1(52.44,23.51) v1(54.57,31.05) v1(54.57,29.17) v1(54.57,27.28) v1(54.57,25.4) v1(54.57,23.51) v1(56.7,31.05) v1(56.7,29.17) v1(56.7,27.28) v1(56.7,25.4) v1(56.7,23.51) v1(59.2,31.05) v1(59.2,29.17) v1(59.2,27.28) v1(59.2,25.4) v1(59.2,23.51) v1(61.33,31.06) v1(61.33,29.17) v1(61.33,27.29) v1(61.33,25.4) v1(61.33,23.52) v1(63.34,31.05) v1(63.34,29.17) v1(63.34,27.28) v1(63.34,25.4) v1(63.34,23.51) v1(65.47,31.05) v1(65.47,29.17) v1(65.47,27.28) v1(65.47,25.4) v1(65.47,23.51) v1(67.09,19.88) v1(67.09,17.99) v1(67.09,16.11) v1(67.09,14.22) v1(67.09,12.34) v1(67.6,31.05) v1(67.6,29.17) v1(67.6,27.28) v1(67.6,25.4) v1(67.6,23.51) v1(69.2,19.88) v1(69.2,17.99) v1(69.2,16.11) v1(69.2,14.23) v1(69.2,12.34) v1(69.71,31.06) v1(69.71,29.17) v1(69.71,27.29) v1(69.71,25.4) v1(69.71,23.52)
$1N15969: length 5
  Top Layer w0.508: Q7.1 68.45,37.41 69.09,36.77 R34.2
$1N15984: length 3.6
  Top Layer w0.508: 67.92,35.04 68.16,35.04 R34.1 ; 67.92,35.04 67.94,35.06 Q8.3 ; 67.92,35.04 R35.1
$1N16017:
  vias: v1(75.46,31.05) v1(75.46,29.17) v1(75.46,27.28) v1(75.46,25.4) v1(75.46,23.51) v1(77.88,25.4) v1(77.88,23.51) v1(80.12,31.05) v1(80.12,29.17) v1(80.12,27.28) v1(80.12,25.4) v1(80.12,23.51) v1(82.25,31.05) v1(82.25,29.17) v1(82.25,27.28) v1(82.25,25.4) v1(82.25,23.51) v1(84.38,31.05) v1(84.38,29.17) v1(84.38,27.28) v1(84.38,25.4) v1(84.38,23.51) v1(86.88,31.05) v1(86.88,29.17) v1(86.88,27.28) v1(86.88,25.4) v1(86.88,23.51) v1(89.01,31.06) v1(89.01,29.17) v1(89.01,27.29) v1(89.01,25.4) v1(89.01,23.52) v1(91.03,31.05) v1(91.03,29.17) v1(91.03,27.28) v1(91.03,25.4) v1(91.03,23.51) v1(93.15,31.05) v1(93.15,29.17) v1(93.15,27.28) v1(93.15,25.4) v1(93.15,23.51) v1(94.78,19.88) v1(94.78,17.99) v1(94.78,16.11) v1(94.78,14.22) v1(94.78,12.34) v1(95.28,31.05) v1(95.28,29.17) v1(95.28,27.28) v1(95.28,25.4) v1(95.28,23.51) v1(96.89,19.88) v1(96.89,17.99) v1(96.89,16.11) v1(96.89,14.23) v1(96.89,12.34) v1(97.39,31.06) v1(97.39,29.17) v1(97.39,27.29) v1(97.39,25.4) v1(97.39,23.52)
$1N16027: length 5
  Top Layer w0.508: R37.2 96.77,36.77 96.27,37.28 93.35,37.28 Q9.1
$1N16042: length 3.6
  Top Layer w0.508: R37.1 95.84,35.04 ; 95.84,35.04 R38.1 ; 95.84,35.04 95.63,35.25 Q10.3
$1N16499: length 2.9
  Top Layer w0.254: H5.1 88.52,59.25 U2.25
$1N21869: length 8.6
  Top Layer w0.254: U19.5 10.54,60.87
  Top Layer w0.508: 10.54,60.87 4.77,60.87 P3.4
$1N21900: length 8.6
  Top Layer w0.254: U20.5 10.54,44.36
  Top Layer w0.508: 10.54,44.36 4.77,44.36 P4.4
$1N21931: length 8.6
  Top Layer w0.254: U1.5 10.54,27.85
  Top Layer w0.508: 10.54,27.85 4.77,27.85 P1.4
$1N21962: length 8.6
  Top Layer w0.254: U15.5 10.54,11.34
  Top Layer w0.508: P2.4 4.77,11.34 10.54,11.34
$1N26684: length 17.9
  Top Layer w0.254: SW3.4 32,31.54 20.42,31.54 18.04,29.15 U1.26
$1N26689: length 15.6
  Top Layer w0.254: SW3.5 29.82,31.18 20.58,31.18 19.08,29.68 19.08,29.14 18.43,28.5 U1.25
$1N26694: length 12.4
  Top Layer w0.254: U1.24 18.29,27.85 19.43,28.99 19.43,29.53 19.94,30.04 SW3.6
$1N31357: length 17.9
  Top Layer w0.254: U15.26 18.04,12.64 20.42,15.03 32.03,15.03 SW4.4
$1N31361: length 15.7
  Top Layer w0.254: SW4.5 29.84,14.67 20.58,14.67 19.08,13.17 19.08,12.66 18.41,11.99 U15.25
$1N31366: length 12.4
  Top Layer w0.254: U15.24 18.26,11.34 19.43,12.51 19.43,13.02 19.94,13.53 SW4.6
$1N31401: length 17.9
  Top Layer w0.254: 33.5,46.55 31.98,48.07 20.45,48.07 18.04,45.66 U20.26
$1N31405: length 15.6
  Top Layer w0.254: 30.96,46.55 29.82,47.69 20.57,47.69 20.07,47.18 20.07,47.18 19.08,46.19 19.08,45.68 18.4,45.01 U20.25
$1N31410: length 12.4
  Top Layer w0.254: U20.24 18.29,44.36 19.43,45.5 19.43,46.04 19.94,46.55 28.42,46.55
$1N31447: length 17.9
  Top Layer w0.254: U19.26 18.04,62.17 20.42,64.56 32,64.56 SW5.4
$1N31451: length 15.6
  Top Layer w0.254: U19.25 18.28,61.52 19.08,62.32 19.08,62.7 19.93,63.56 19.94,63.56 20.57,64.2 29.82,64.2 SW5.5
$1N31456: length 12.4
  Top Layer w0.254: U19.24 18.26,60.87 19.43,62.04 19.43,62.56 19.93,63.06 SW5.6

## Copper pours and planes (outline as drawn; the poured copper is in the pictures)
3V3 on Bottom Layer: 128.48,71.52 148.38,71.52 148.38,70.88 128.48,70.88
3V3 on Bottom Layer: 147.92,75.29 148.84,75.29 148.84,41.34 147.92,41.34
3V3 on Bottom Layer: 130.94,42.61 150.75,42.61 150.75,40.07 130.94,40.07
3V3 on Bottom Layer: 69.6,41.47 140.21,41.47 140.21,40.83 69.6,40.83
12V on Bottom Layer: 64.26,40.58 130.68,40.58 130.68,39.94 64.26,39.94
GND on Top Layer: 77.34,39.43 91.69,39.43 91.69,32.7 77.34,32.7
GND on Top Layer: 132.72,39.43 147.07,39.43 147.07,32.7 132.72,32.7
GND on Top Layer: 79.25,72.45 83.31,72.45 83.31,68.39 79.25,68.39
GND on Top Layer: 105.03,39.43 119.38,39.43 119.38,32.7 105.03,32.7
GND on Top Layer: 49.66,39.43 64.01,39.43 64.01,32.7 49.66,32.7
GND on Bottom Layer: 0,79.69 156.53,79.69 156.53,0 0,0
NFAULT on Bottom Layer: 18.29,57.34 19.18,57.34 19.18,7.05 18.29,7.05
V_MOSFET1 on Top Layer: 49.66,22.29 63.88,22.29 63.88,0.32 49.66,0.32
V_MOSFET2 on Top Layer: 77.34,22.29 91.57,22.29 91.57,0.32 77.34,0.32
V_MOSFET3 on Top Layer: 105.03,22.29 119.25,22.29 119.25,0.32 105.03,0.32
V_MOSFET4 on Top Layer: 132.72,22.29 146.94,22.29 146.94,0.32 132.72,0.32
V_STEPPER on Bottom Layer: 5.84,69.44 8.76,69.44 8.76,3.87 5.84,3.87
$1N7080 on Top Layer: 120.78,31.43 126.75,31.43 126.75,0.3 120.78,0.3
$1N7080 on Top Layer: 101.85,33.34 113.16,33.34 113.16,23.05 101.85,23.05
$1N7080 on Bottom Layer: 99.17,32.23 125.48,32.23 125.48,10.58 99.17,10.58
$1N14832 on Top Layer: 129.54,33.34 140.84,33.34 140.84,23.05 129.54,23.05
$1N14832 on Top Layer: 148.46,31.43 154.44,31.43 154.44,0.3 148.46,0.3
$1N14832 on Bottom Layer: 126.85,32.23 153.17,32.23 153.17,10.58 126.85,10.58
$1N15959 on Top Layer: 51.82,31.43 58.04,31.43 58.04,23.05 51.82,23.05
$1N15959 on Top Layer: 65.41,31.43 71.38,31.43 71.38,0.3 65.41,0.3
$1N15959 on Top Layer: 46.48,27.62 51.82,27.62 51.82,23.05 46.48,23.05
$1N15959 on Top Layer: 46.48,33.34 48.78,33.34 48.78,27.62 46.48,27.62
$1N15959 on Bottom Layer: 43.8,32.23 70.11,32.23 70.11,10.58 43.8,10.58
$1N16017 on Top Layer: 74.17,33.34 85.47,33.34 85.47,23.05 74.17,23.05
$1N16017 on Top Layer: 93.09,31.43 99.06,31.43 99.06,0.3 93.09,0.3
$1N16017 on Bottom Layer: 71.48,32.23 97.79,32.23 97.79,10.58 71.48,10.58

Small or netless copper shapes (teardrops, artwork), in the pictures only: 657 on Top Layer, 28 on Bottom Layer

## Text on the board
Top Silkscreen Layer: MOSFET1 | MOSFET2 | UART | MOSFET3 | LEDs | MOSFET4 | SW1 | SW2 | E-STOP | SW3 | SW4 | SW5 | SW6 | SW7 | 3V3 | + 5V - | VBUS | STEPPER 1 | STEPPER 2 | STEPPER 3 | STEPPER 4 | A1 | A2 | B2 | B1 | + | - | MOSFETs ⚠ MAX 24V 30A | - PWR + | + LD - | STEPPERS  ⚠ MAX 2.5A EACH | CNC Router/3D Printer Controller Board | ESP32-CNC | GPIO13 | GPIO14 | TXD0 | RXD0 | GND | GPIO21 | GPIO38 | GPIO47 | GPIO2 | GPIO1 | GP42 | GPIO41 | GPIO40 | GPIO39 | GPIO48 | No hardware / debounce | Sponsors | STEPPERS / 12-24V
